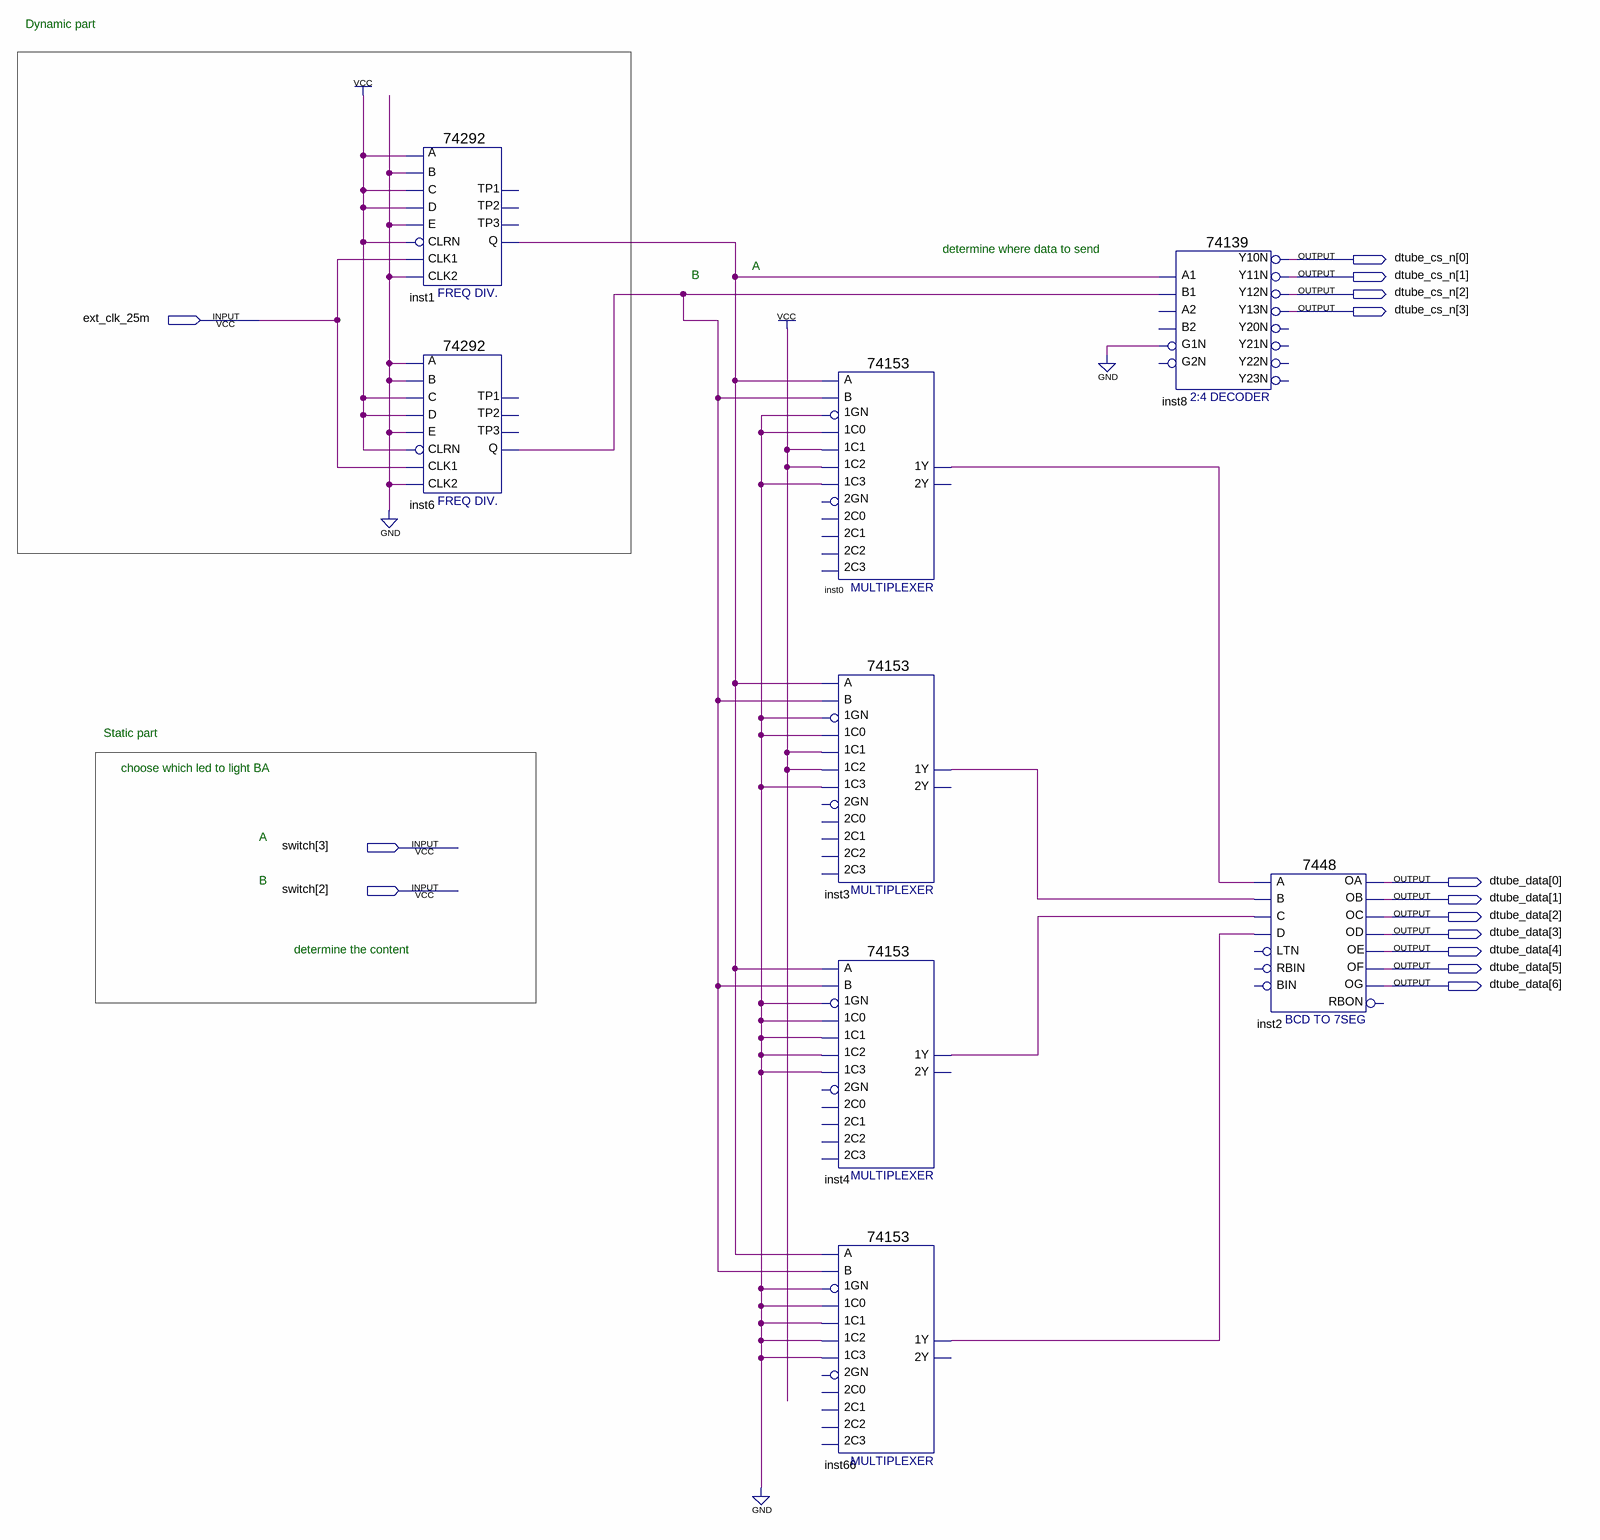
[diagram p0: schematic sheet]
// Quartus schematic LEDdesign.bdf as structural Verilog: 8 symbols, 14 pins
module LEDdesign (
  input  ext_clk_25m,
  input  [3:2] switch,
  output [3:0] dtube_cs_n,
  output [6:0] dtube_data
);

  wire inst0_1y, inst1_q, inst3_1y, inst4_1y, inst6_q, inst66_1y;

  \74292  inst1 (
    .A(1'b1), .D(1'b1), .C(1'b1), .B(1'b0), .CLK1(ext_clk_25m), .CLRN(1'b1), .E(1'b0), .CLK2(1'b0),
    .Q(inst1_q));  // open: TP2, TP1, TP3
  \74292  inst6 (
    .A(1'b0), .D(1'b1), .C(1'b1), .B(1'b0), .CLK1(ext_clk_25m), .CLRN(1'b1), .E(1'b0), .CLK2(1'b0),
    .Q(inst6_q));  // open: TP2, TP1, TP3
  \74153  inst0 (
    .\1C1 (1'b1), .\1GN (1'b0), .\1C0 (1'b0), .\1C2 (1'b1), .\1C3 (1'b0), .B(inst6_q), .A(inst1_q),
    .\1Y (inst0_1y));  // open: 2C0, 2GN, 2C2, 2C1, 2C3, 2Y
  \74153  inst3 (
    .\1C1 (1'b1), .\1GN (1'b0), .\1C0 (1'b0), .\1C2 (1'b1), .\1C3 (1'b0), .B(inst6_q), .A(inst1_q),
    .\1Y (inst3_1y));  // open: 2C0, 2GN, 2C2, 2C1, 2C3, 2Y
  \74153  inst4 (
    .\1C1 (1'b0), .\1GN (1'b0), .\1C0 (1'b0), .\1C2 (1'b0), .\1C3 (1'b0), .B(inst6_q), .A(inst1_q),
    .\1Y (inst4_1y));  // open: 2C0, 2GN, 2C2, 2C1, 2C3, 2Y
  \74153  inst66 (
    .\1C1 (1'b0), .\1GN (1'b0), .\1C0 (1'b0), .\1C2 (1'b0), .\1C3 (1'b0), .B(inst6_q), .A(inst1_q),
    .\1Y (inst66_1y));  // open: 2C0, 2GN, 2C2, 2C1, 2C3, 2Y
  \74139  inst8 (
    .A1(inst1_q), .B1(inst6_q), .G1N(1'b0), .Y10N(dtube_cs_n[0]), .Y13N(dtube_cs_n[3]), .Y12N(dtube_cs_n[2]),
    .Y11N(dtube_cs_n[1]));  // open: A2, B2, G2N, Y20N, Y21N, Y22N, Y23N
  \7448  inst2 (
    .A(inst0_1y), .C(inst4_1y), .D(inst66_1y), .B(inst3_1y), .OC(dtube_data[2]), .OE(dtube_data[4]),
    .OD(dtube_data[3]), .OF(dtube_data[5]), .OG(dtube_data[6]), .OB(dtube_data[1]), .OA(dtube_data[0]));  // open: RBIN, BIN, LTN, RBON

  // Notes on the sheet:
  //   Dynamic part
  //   determine where data to send
  //   A
  //   B
  //   Static part
  //   choose which led to light BA
  //   A
  //   B
  //   determine the content
endmodule
